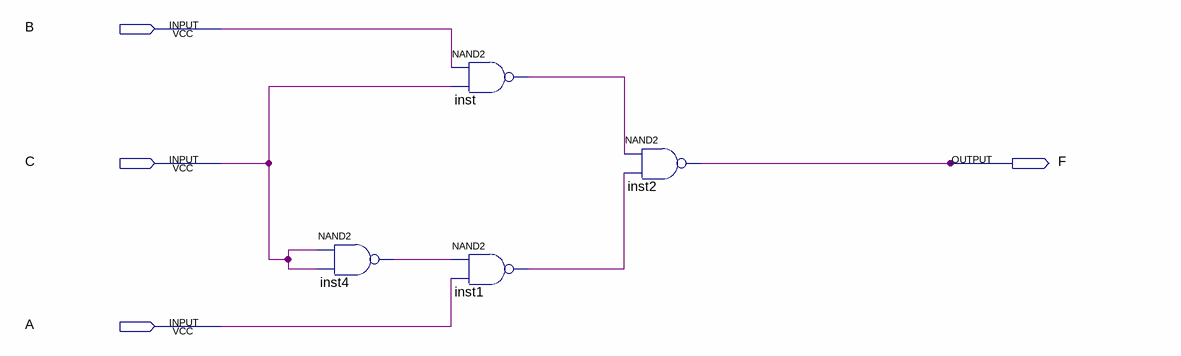
[diagram p0: schematic sheet]
// Quartus schematic q3.bdf as structural Verilog: 4 symbols, 4 pins
module q3 (
  input  B,
  input  C,
  input  A,
  output F
);

  wire inst1_out, inst4_out, inst_out;

  nand inst4 (inst4_out, C, C);
  nand inst (inst_out, B, C);
  nand inst1 (inst1_out, inst4_out, A);
  nand inst2 (F, inst_out, inst1_out);
endmodule
